# Altium schematic sheet Power and Decoupling Capacitors.SchDoc
size A2; SheetNumber: 3; SheetTotal: 8
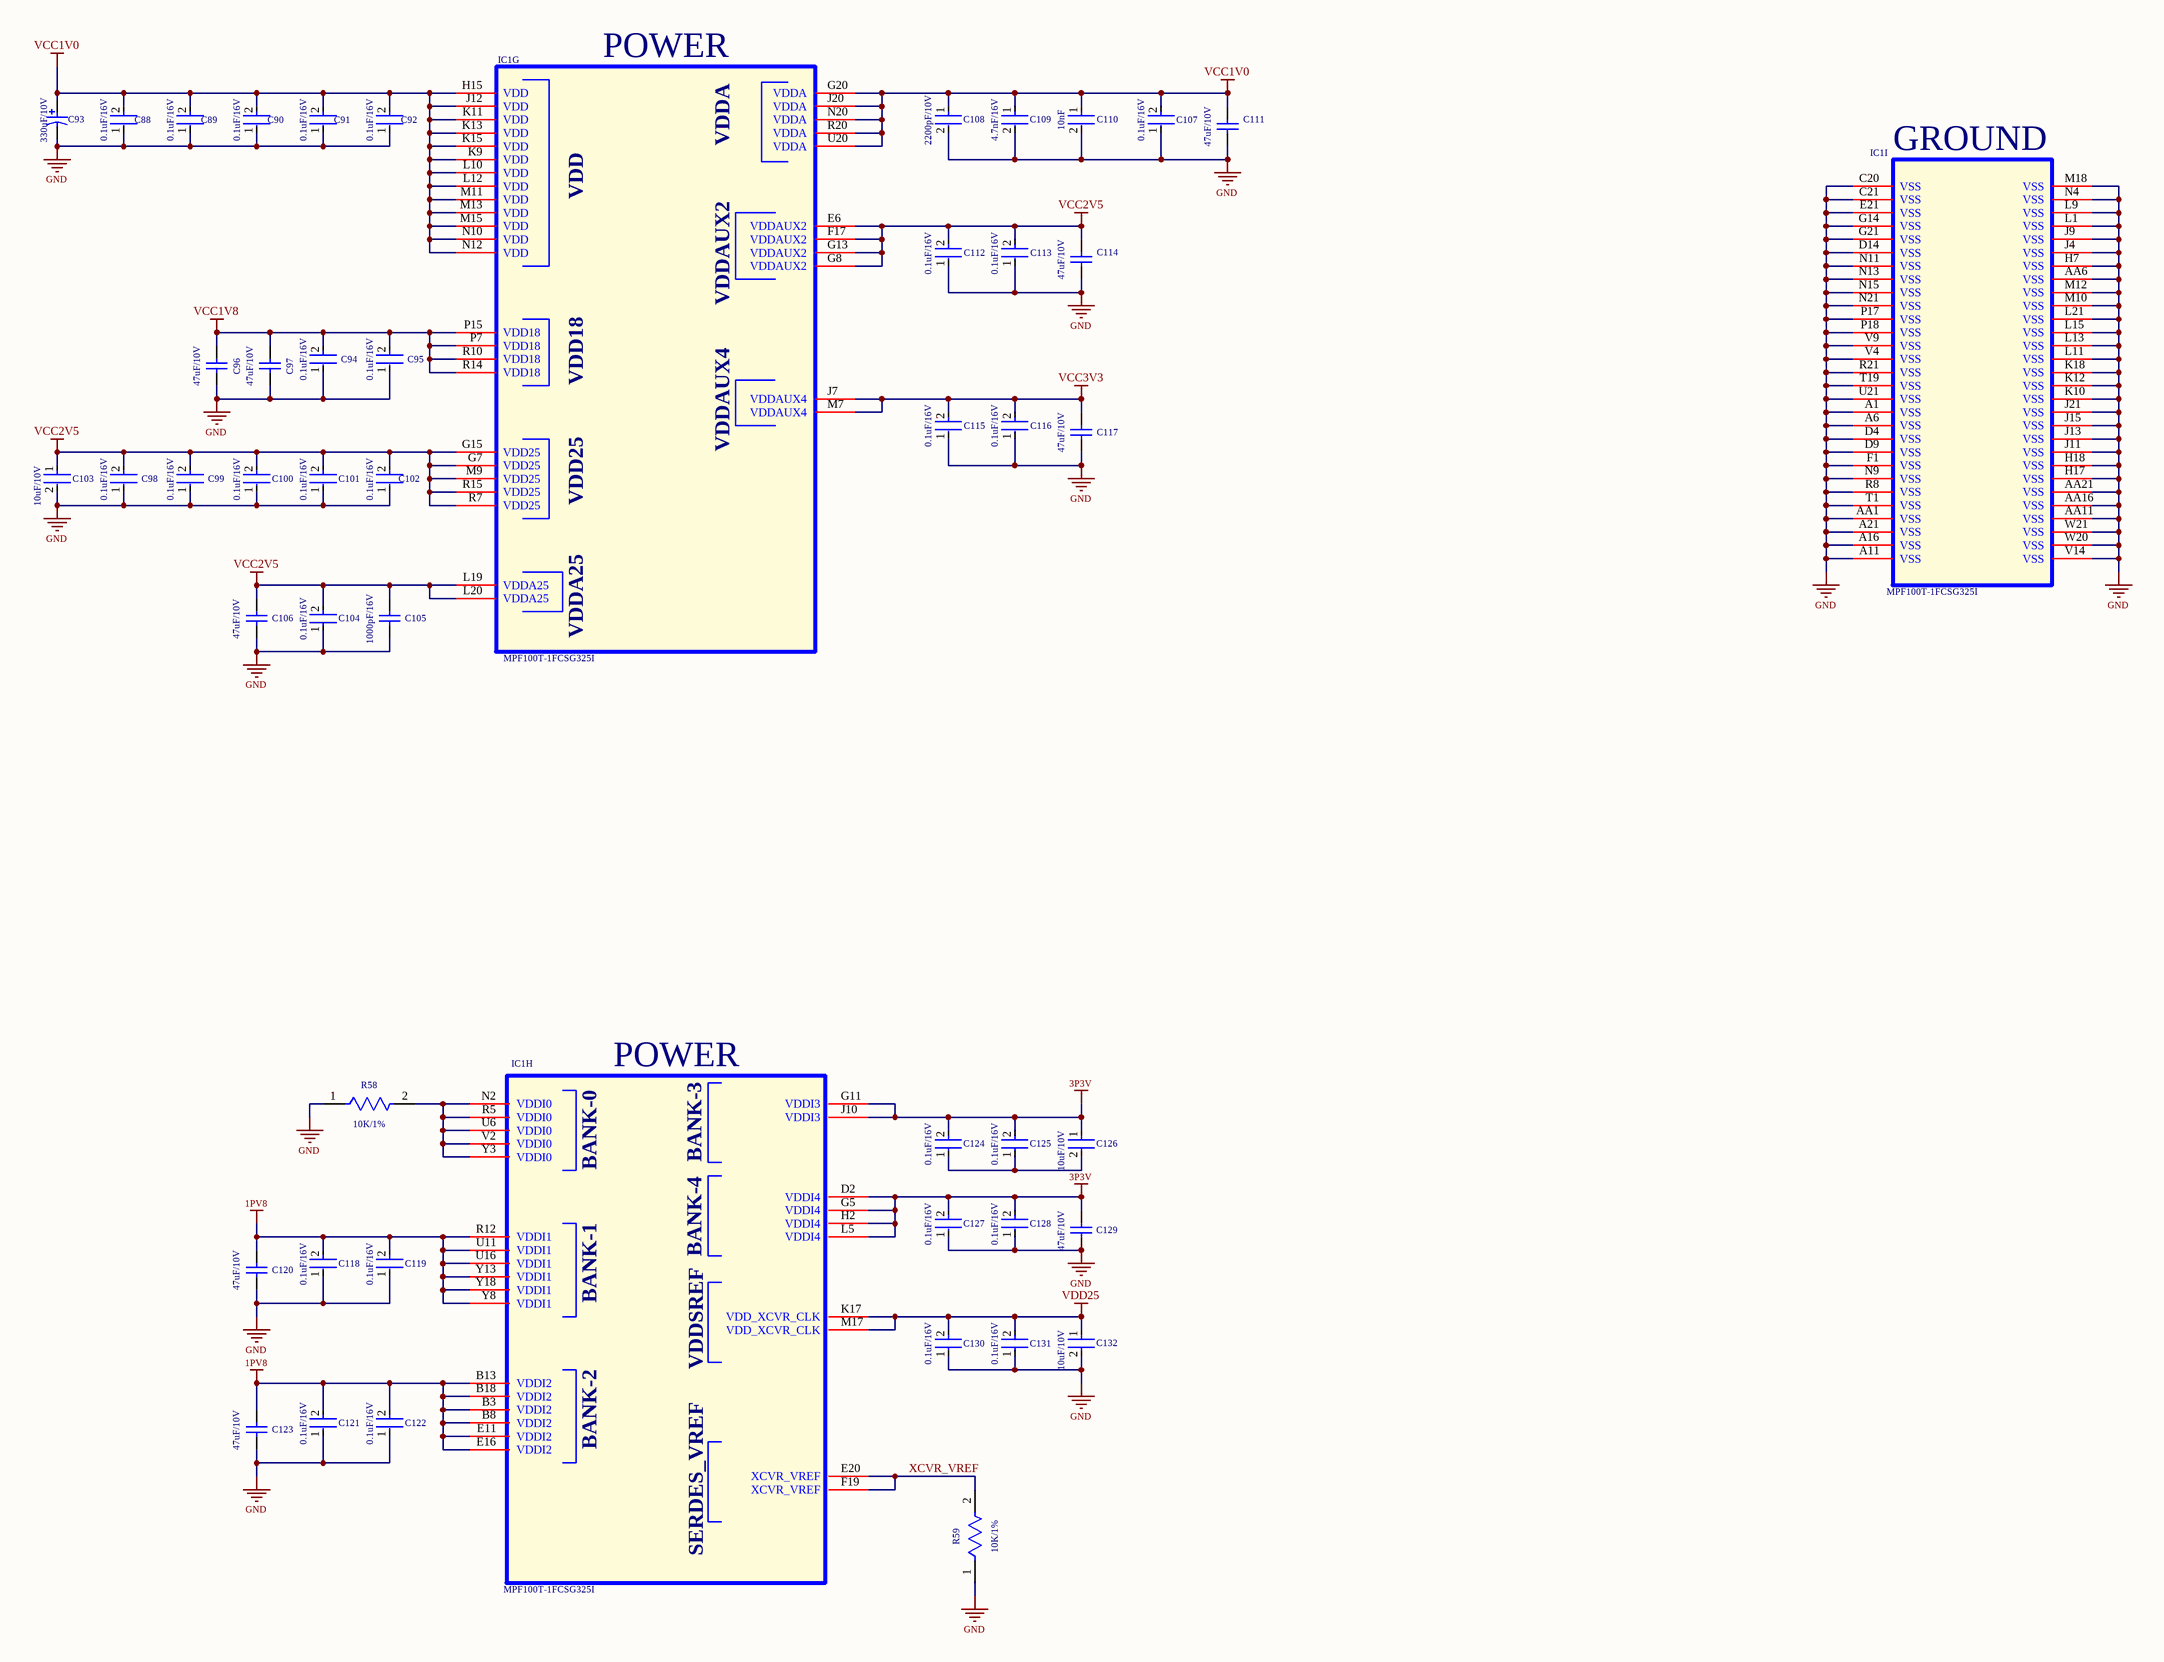
[diagram p0: Power and Decoupling Capacitors.SchDoc]

## Parts
C88  0.1uF/16V  [FP-GRM15-MFG]
C89  0.1uF/16V  [FP-GRM15-MFG]
C90  0.1uF/16V  [FP-GRM15-MFG]
C91  0.1uF/16V  [FP-GRM15-MFG]
C92  0.1uF/16V  [FP-GRM15-MFG]
C93  330uF/10V  [NIC-CAPA2-8X10_V]
C94  0.1uF/16V  [FP-GRM15-MFG]
C95  0.1uF/16V  [FP-GRM15-MFG]
C96  47uF/10V  [CAPC2014X135X70LL20]
C97  47uF/10V  [CAPC2014X135X70LL20]
C98  0.1uF/16V  [FP-GRM15-MFG]
C99  0.1uF/16V  [FP-GRM15-MFG]
C100  0.1uF/16V  [FP-GRM15-MFG]
C101  0.1uF/16V  [FP-GRM15-MFG]
C102  0.1uF/16V  [FP-GRM15-MFG]
C103  10uF/10V  [FP-CL05A106MP5NUNC-MFG]
C104  0.1uF/16V  [FP-GRM15-MFG]
C105  1000pF/16V  [CAPC0603X33X15LL03T05]
C106  47uF/10V  [CAPC2014X135X70LL20]
C107  0.1uF/16V  [FP-GRM15-MFG]
C108  2200pF/10V  [FP-C0402-BB-MFG]
C109  4.7nF/16V  [FP-CC0201-BA-MFG]
C110  10nF  [FP-0402-L_1_0_1-W_0_5_0_1-IPC_B]
C111  47uF/10V  [CAPC2014X135X70LL20]
C112  0.1uF/16V  [FP-GRM15-MFG]
C113  0.1uF/16V  [FP-GRM15-MFG]
C114  47uF/10V  [CAPC2014X135X70LL20]
C115  0.1uF/16V  [FP-GRM15-MFG]
C116  0.1uF/16V  [FP-GRM15-MFG]
C117  47uF/10V  [CAPC2014X135X70LL20]
C118  0.1uF/16V  [FP-GRM15-MFG]
C119  0.1uF/16V  [FP-GRM15-MFG]
C120  47uF/10V  [CAPC2014X135X70LL20]
C121  0.1uF/16V  [FP-GRM15-MFG]
C122  0.1uF/16V  [FP-GRM15-MFG]
C123  47uF/10V  [CAPC2014X135X70LL20]
C124  0.1uF/16V  [FP-GRM15-MFG]
C125  0.1uF/16V  [FP-GRM15-MFG]
C126  10uF/10V  [FP-CL05A106MP5NUNC-MFG]
C127  0.1uF/16V  [FP-GRM15-MFG]
C128  0.1uF/16V  [FP-GRM15-MFG]
C129  47uF/10V  [CAPC2014X135X70LL20]
C130  0.1uF/16V  [FP-GRM15-MFG]
C131  0.1uF/16V  [FP-GRM15-MFG]
C132  10uF/10V  [FP-CL05A106MP5NUNC-MFG]
IC1  MPF100T-1FCSG325I  [MPF100T-1FCSG325I]  (parts G,H,I of 9)
R58  10K/1%  [FP-RC0603-0_55-IPC_C]
R59  10K/1%  [FP-RC0603-0_55-IPC_C]

## Nets
1PV8: C118.2 C119.2 C120.1 C121.2 C122.2 C123.1 IC1.B3(VDDI2) IC1.B8(VDDI2) IC1.B13(VDDI2) IC1.B18(VDDI2) IC1.E11(VDDI2) IC1.E16(VDDI2) IC1.R12(VDDI1) IC1.U11(VDDI1) IC1.U16(VDDI1) IC1.Y8(VDDI1) IC1.Y13(VDDI1) IC1.Y18(VDDI1)
3P3V: C124.2 C125.2 C126.1 C127.2 C128.2 C129.1 IC1.D2(VDDI4) IC1.G5(VDDI4) IC1.G11(VDDI3) IC1.H2(VDDI4) IC1.J10(VDDI3) IC1.L5(VDDI4)
GND: C88.1 C89.1 C90.1 C91.1 C92.1 C93.2 C94.1 C95.1 C96.2 C97.2 C98.1 C99.1 C100.1 C101.1 C102.1 C103.2 C104.1 C105.1 C106.2 C107.1 C108.2 C109.2 C110.2 C111.2 C112.1 C113.1 C114.2 C115.1 C116.1 C117.2 C118.1 C119.1 C120.2 C121.1 C122.1 C123.2 C127.1 C128.1 C129.2 C130.1 C131.1 C132.2 IC1.A1(VSS) IC1.A6(VSS) IC1.A11(VSS) IC1.A16(VSS) IC1.A21(VSS) IC1.AA1(VSS) IC1.AA6(VSS) IC1.AA11(VSS) IC1.AA16(VSS) IC1.AA21(VSS) IC1.C20(VSS) IC1.C21(VSS) IC1.D4(VSS) IC1.D9(VSS) IC1.D14(VSS) IC1.E21(VSS) IC1.F1(VSS) IC1.G14(VSS) IC1.G21(VSS) IC1.H7(VSS) IC1.H17(VSS) IC1.H18(VSS) IC1.J4(VSS) IC1.J9(VSS) IC1.J11(VSS) IC1.J13(VSS) IC1.J15(VSS) IC1.J21(VSS) IC1.K10(VSS) IC1.K12(VSS) IC1.K18(VSS) IC1.L1(VSS) IC1.L9(VSS) IC1.L11(VSS) IC1.L13(VSS) IC1.L15(VSS) IC1.L21(VSS) IC1.M10(VSS) IC1.M12(VSS) IC1.M18(VSS) IC1.N4(VSS) IC1.N9(VSS) IC1.N11(VSS) IC1.N13(VSS) IC1.N15(VSS) IC1.N21(VSS) IC1.P17(VSS) IC1.P18(VSS) IC1.R8(VSS) IC1.R21(VSS) IC1.T1(VSS) IC1.T19(VSS) IC1.U21(VSS) IC1.V4(VSS) IC1.V9(VSS) IC1.V14(VSS) IC1.W20(VSS) IC1.W21(VSS) R58.1 R59.1
VCC1V0: C88.2 C89.2 C90.2 C91.2 C92.2 C93.1 C107.2 C108.1 C109.1 C110.1 C111.1 IC1.G20(VDDA) IC1.H15(VDD) IC1.J12(VDD) IC1.J20(VDDA) IC1.K9(VDD) IC1.K11(VDD) IC1.K13(VDD) IC1.K15(VDD) IC1.L10(VDD) IC1.L12(VDD) IC1.M11(VDD) IC1.M13(VDD) IC1.M15(VDD) IC1.N10(VDD) IC1.N12(VDD) IC1.N20(VDDA) IC1.R20(VDDA) IC1.U20(VDDA)
VCC1V8: C94.2 C95.2 C96.1 C97.1 IC1.P7(VDD18) IC1.P15(VDD18) IC1.R10(VDD18) IC1.R14(VDD18)
VCC2V5: C98.2 C99.2 C100.2 C101.2 C102.2 C103.1 C104.2 C105.2 C106.1 C112.2 C113.2 C114.1 IC1.E6(VDDAUX2) IC1.F17(VDDAUX2) IC1.G7(VDD25) IC1.G8(VDDAUX2) IC1.G13(VDDAUX2) IC1.G15(VDD25) IC1.L19(VDDA25) IC1.L20(VDDA25) IC1.M9(VDD25) IC1.R7(VDD25) IC1.R15(VDD25)
VCC3V3: C115.2 C116.2 C117.1 IC1.J7(VDDAUX4) IC1.M7(VDDAUX4)
VDD25: C130.2 C131.2 C132.1 IC1.K17(VDD_XCVR_CLK) IC1.M17(VDD_XCVR_CLK)
XCVR_VREF: IC1.E20(XCVR_VREF) IC1.F19(XCVR_VREF) R59.2
NetC124_1: C124.1 C125.1 C126.2
NetIC1_N2: IC1.N2(VDDI0) IC1.R5(VDDI0) IC1.U6(VDDI0) IC1.V2(VDDI0) IC1.Y3(VDDI0) R58.2

## Notes on the sheet
- (in symbol MPF100T-1FCSG325I, part G) POWER
- (in symbol MPF100T-1FCSG325I, part H) POWER; BANK-3; BANK-0; BANK-4; BANK-1; VDDSREF; BANK-2; SERDES_VREF
- (in symbol MPF100T-1FCSG325I, part I) GROUND

## Library data of the parts
C88-C92 C94 C95 C98-C102 C104 C107 C112 C113 C115 C116 C118 C119 C121 C122 C124 C125 C127 C128 C130 C131 = CMP-2100-03641-2: CAP CER 0.1UF 16V X7R 0402; Manufacturer Part Number: GRM155R71C104KA88D; Manufacturer: Murata; Standoff Height: 0mm; Tolerance: 10%; Voltage Rating: 16Vdc; Material: Ceramic; Capacitance: 0.10μF; Value: 0.10μF; RoHS: TRUE; Temperature Characteristic: X7R; Octopart: https://octopart.com/grm155r71c104ka88d-murata-196880; Digikey Description: CAP CER 0.1UF 16V X7R 0402; Device Class L3: Ceramic Capacitors; Height: 0.55mm; ComponentLink2Description: Datasheet; Temperature Range Low: -55°C; Ipc Land Pattern Name: CAPC10050X219; ComponentLink2URL: https://search.murata.co.jp/Ceramy/image/img/A01X/G101/ENG/GRM155R71H471KA01-01A.pdf; Device Class L1: Passive Components; Lead Free: yes; Category: Cap; Package: GRM15; Temperature: -55°C to +125°C; Device Class L2: Capacitors; Temperature Range High: +125°C; Mouser Description: 0402 0.1 uF 16V ±10 % Tolerance X7R SMT Multilayer Ceramic Capacitor
C93 = CMP-0687-00065-1: Aluminum Electrolytic Capacitor, UD Series, Low Impedance, 330 uF, 16 V, + / - 20%, -55 to 105 degC, Chip Type, 8 x 10 mm D x L, Pb-Free, Reel; Manufacturer: Nichicon; PartNumber: UUD1C331MNL1GS; Rated Ripple Current (at 100kHz): 450 mA; Rated Voltage: 16 V; Packing: Dia382mm Reel; Rated Capacitance: 330 uF; Impedance: 0.17 Ohm; Tolerance Rated Capacitance: -20 to 20%; Endurance Time: 5000 h; ComponentLink1URL: http://www.nichicon.co.jp/; RoHS: TRUE; ComponentLink3Description: Package Specification; ComponentLink2URL: http://products.nichicon.co.jp/en/pdf/XJA043/e-ud.pdf; ComponentLink1Description: Manufacturer URL; DatasheetVersion: 08/2012; Length: 10 mm; Mounting Technology: Surface Mount; ComponentLink2Description: Datasheet; ComponentLink3URL: http://products.nichicon.co.jp/en/pdf/XJA043/e-ud.pdf; Diameter: 8 mm; PackageDescription: 2-Pin Surface Mount Device, Diameter 8 mm, Height 10 mm, Pitch 6.5 mm; PackageReference: CAPAE-D8H10
C96 C97 C106 C111 C114 C117 C120 C123 C129 = CMP-2007-00047-1: Part Number: TLCR476M010XTA; Manufacturer: AVX Interconnect / Elco
C103 C126 C132 = CMP-13271-000002-1: CAP CER 10UF 10V X5R 0402; Manufacturer Part Number: CL05A106MP5NUNC; Manufacturer: Samsung; Temperature Coefficient: 15%; Tolerance: 20%; Material: Ceramic; Octopart: https://octopart.com/cl05a106mp5nunc-samsung-22457395; Voltage Rating: 10V; RoHS: TRUE; Value: 10uF; Height: 0.7mm; Digikey Description: CAP CER 10UF 10V X5R 0402; Automotive: No; Package: CL05A106MP5NUNC; Device Class L1: Passive Components; Capacitance: 10uF; Temperature Range High: +85°C; ComponentLink2Description: Datasheet; Device Class L2: Capacitors; Temperature Characteristic: X5R; Temperature: -55°C to +85°C; ComponentLink2URL: http://www.samsungsem.com/kr/support/product-search/mlcc/__icsFiles/afieldfile/2019/05/10/19-CL05A106MP5NUNC.pdf; Device Class L3: Ceramic Capacitors; Category: Cap; Temperature Range Low: -55°C; Ipc Land Pattern Name: CAPC10050X50; Lead Free: Yes
C105 = CMP-1033-00594-2: Part Number: 02013D102KAT2A; Manufacturer: AVX Interconnect / Elco
C108 = CMP-2008-03290-2: CAP CER 2200PF 25V 5% NP0 0402; Manufacturer: Kemet; Manufacturer Part Number: C0402C222J3GACTU; Temperature Characteristic: C0G; Temperature Coefficient: 15%; Value: 2,200 pF; Material: Ceramic; Tolerance: 0.05; Temperature: -55°C to +125°C; ComponentLink2URL: https://content.kemet.com/datasheets/KEM_C1002_X7R_SMD.pdf; Octopart: https://octopart.com/c0402c222j3gactu-kemet-9145102; Ipc Land Pattern Name: CAPC10050X50; RoHS: TRUE; Temperature Range High: +125°C; Device Class L3: Ceramic Capacitors; Device Class L1: Passive Components; Digikey Description: CAP CER 2200PF 25V 5% NP0 0402; Capacitance: 2,200 pF; Voltage Rating: 25 V; Automotive: No; Lead Free: Yes; ComponentLink2Description: Datasheet; Package: C0402-BB; Temperature Range Low: -55°C; Device Class L2: Capacitors; Height: 0.55mm; Category: Cap; Mouser Description: Multilayer Ceramic Capacitors MLCC - SMD/SMT 25V 0.0022uF 5% C0G
C109 = CMP-03422-000880-1: CAP CER 4700PF 16V X7R 0201; Manufacturer Part Number: CC0201KRX7R7BB472; Manufacturer: Yageo; Value: 4.7 nF; Material: Ceramic; Temperature Coefficient: 15%; Tolerance: 0.1; Ipc Land Pattern Name: CAPC6030X30; Automotive: No; Lead Free: Yes; Digikey Description: CAP CER 4700PF 16V X7R 0201; Height: 0.33mm; Temperature Characteristic: X7R; ComponentLink2Description: Datasheet; Temperature: -55°C to +85°C; Octopart: https://octopart.com/cc0201krx7r7bb472-yageo-33242265; ComponentLink2URL: http://www.yageo.com/documents/recent/UPY-GPHC_X5R_4V-to-50V_25.pdf; Temperature Range Low: -55°C; Footprint Url: http://www.yageo.com/exep/pages/download/literatures/UPY-C_GEN_24.pdf; RoHS: TRUE; Temperature Range High: +85°C; Device Class L2: Capacitors; Category: Cap; Voltage Rating: 16 V; Mouser Description: Multilayer Ceramic Capacitors MLCC - SMD/SMT 4.7nF 16V X7R 10%; Device Class L1: Passive Components; Device Class L3: Ceramic Capacitors; Package: CC0201-BA; Capacitance: 4.7 nF
C110 = CMP-2008-02796-2: General Purpose Ceramic Capacitor, 0402, 10nF, 5%, X7R, 15%, 16V; Construction: Flat; Case Code (Metric): 1005; Lead Free: Lead Free; Radiation Hardening: No; REACH SVHC: No SVHC; Max Operating Temperature: 125°C; Case/Package: 0402; Dielectric: X7R; Case Code (Imperial): 0402; Length: 1mm; Width: 0.5mm; Capacitance: 10nF; Packaging: Tape and Reel; Depth: 0.5mm; Voltage: 16V; Termination: SMD/SMT; Contact Plating: Tin; Min Operating Temperature: -55°C; Mount: Surface Mount; Tolerance: 5%; Series: -; RoHS Compliant: Yes; Package Quantity: 10000; Thickness: 0.022inch; Height: 0.5mm; Voltage Rating (DC): 16V; Voltage Rating: 16V
IC1 = MPF100T-1FCSG325I: Part_Number: J00001; Part_Name: Jumper; ID: 110; Mounting_Type: SMT; ComponentLink1Description: Datasheet
R58 R59 = CMP-2100-03664-2: RES 10K OHM 1% 1/10W 0603; Voltage Rating: 75V; Voltage Rating (DC): 50V; Resistance: 10kR; Power Rating: 100mW; Temperature Coefficient: 100ppm/°C; Depth: 0.8mm; Termination: SMD/SMT; Resistor Type: Thick Film; Series: RC; Construction: Rectangular; Features: Moisture Resistant; Packaging: Tape and Reel; Min Operating Temperature: -55°C; Number of Terminations: 2; Lead Pitch: 0.3mm; RoHS Compliant: Yes; Case/Package: 0603; Resistance Tolerance: 1%; Military Standard: Not; Weight: 7.1E-05oz; Number of Pins: 2; Tolerance: 1%; Length: 1.6mm; Case Code (Imperial): 0603; Lead Free: Lead Free; Width: 0.8mm; Max Power Dissipation: 100mW; Height: 0.45mm; Max Operating Temperature: 155°C; Case Code (Metric): 1608; Size Code: 0603